# Altium schematic sheet core.SchDoc
size A4; Organization: GPA Robotics; DocumentNumber: 3; Revision: REV 0; SheetNumber: 3; SheetTotal: 4
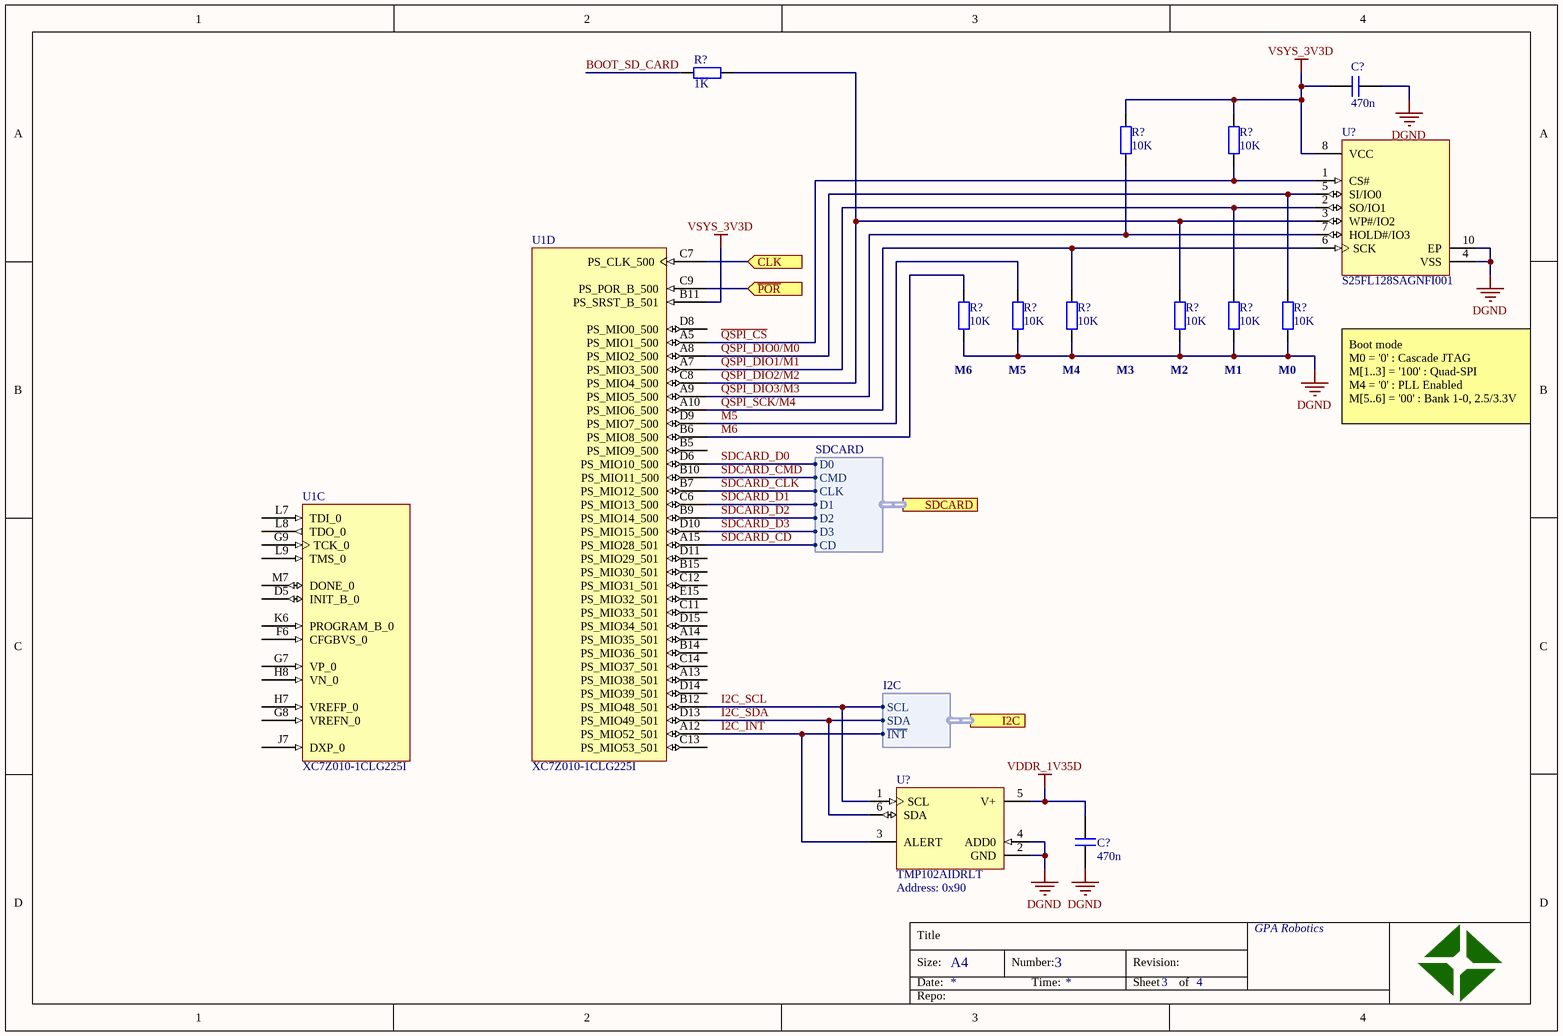
[diagram p0: core.SchDoc]

## Parts
(Parts that share a designator on the sheet are numbered #1, #2 ... from top to bottom, then left to right.)
C?#1  value 470n  [CAPC1608X08N]  (hidden comment: cap)
C?#2  value 470n  [CAPC1608X08N]  (hidden comment: cap)
R?#1  value 1K  [RESC1005X04N]  (hidden comment: res)
R?#2  value 10K  [RESC1005X04N]  (hidden comment: res)
R?#3  value 10K  [RESC1005X04N]  (hidden comment: res)
R?#4  value 10K  [RESC1005X04N]  (hidden comment: res)
R?#5  value 10K  [RESC1005X04N]  (hidden comment: res)
R?#6  value 10K  [RESC1005X04N]  (hidden comment: res)
R?#7  value 10K  [RESC1005X04N]  (hidden comment: res)
R?#8  value 10K  [RESC1005X04N]  (hidden comment: res)
R?#9  value 10K  [RESC1005X04N]  (hidden comment: res)
U1  XC7Z010-1CLG225I  [CLG225]  (parts C,D of 8)
U?#1  S25FL128SAGNFI001  [SPSN-WSON-8_N]
U?#2  TMP102AIDRLT  Address: 0x90  [DRL0006A_L]

## Ports
CLK (in), I2C (harness I2C), SDCARD (harness SDCARD), ~{POR} (in)

## Harnesses
I2C: SDA, SCL, ~{INT}
SDCARD: D0, D1, D2, D3, CMD, CLK, CD

## Nets
DGND: C?#1.1 C?#2.2 R?#4.1 R?#5.1 R?#6.1 R?#7.1 R?#8.1 R?#9.1 U?#1.4(VSS) U?#1.10(EP) U?#2.2(GND) U?#2.4(ADD0)
VDDR_1V35D: C?#2.1 U?#2.5(V+)
VSYS_3V3D: C?#1.2 R?#2.2 R?#3.2 U1.B11(PS_SRST_B_501) U?#1.8(VCC)
~{POR}: U1.C9(PS_POR_B_500) ; port ~{POR}
~{QSPI_CS}: R?#3.1 U1.A5(PS_MIO1_500) U?#1.1(CS#)
BOOT_SD_CARD: R?#1.2
CLK: U1.C7(PS_CLK_500) ; port CLK
I2C_INT: U1.A12(PS_MIO52_501) U?#2.3(ALERT) ; port I2C.~{INT}
I2C_SCL: U1.B12(PS_MIO48_501) U?#2.1(SCL) ; port I2C.SCL
I2C_SDA: U1.D13(PS_MIO49_501) U?#2.6(SDA) ; port I2C.SDA
M5: R?#5.2 U1.D9(PS_MIO7_500)
M6: R?#4.2 U1.B6(PS_MIO8_500)
QSPI_DIO0/M0: R?#9.2 U1.A8(PS_MIO2_500) U?#1.5(SI/IO0)
QSPI_DIO1/M1: R?#8.2 U1.A7(PS_MIO3_500) U?#1.2(SO/IO1)
QSPI_DIO2/M2: R?#1.1 R?#7.2 U1.C8(PS_MIO4_500) U?#1.3(WP#/IO2)
QSPI_DIO3/M3: R?#2.1 U1.A9(PS_MIO5_500) U?#1.7(HOLD#/IO3)
QSPI_SCK/M4: R?#6.2 U1.A10(PS_MIO6_500) U?#1.6(SCK)
SDCARD_CD: U1.A15(PS_MIO28_501) ; port SDCARD.CD
SDCARD_CLK: U1.B7(PS_MIO12_500) ; port SDCARD.CLK
SDCARD_CMD: U1.B10(PS_MIO11_500) ; port SDCARD.CMD
SDCARD_D0: U1.D6(PS_MIO10_500) ; port SDCARD.D0
SDCARD_D1: U1.C6(PS_MIO13_500) ; port SDCARD.D1
SDCARD_D2: U1.B9(PS_MIO14_500) ; port SDCARD.D2
SDCARD_D3: U1.D10(PS_MIO15_500) ; port SDCARD.D3

Not connected (* = marked no-connect by the designer): U1 A13(PS_MIO38_501) A14(PS_MIO35_501) B5(PS_MIO9_500) B14(PS_MIO36_501) B15(PS_MIO30_501) C11(PS_MIO33_501) C12(PS_MIO31_501) C13(PS_MIO53_501) C14(PS_MIO37_501) D5(INIT_B_0) D8(PS_MIO0_500) D11(PS_MIO29_501) D14(PS_MIO39_501) D15(PS_MIO34_501) E15(PS_MIO32_501) F6(CFGBVS_0) G7(VP_0) G8(VREFN_0) G9(TCK_0) H7(VREFP_0) H8(VN_0) J7(DXP_0) K6(PROGRAM_B_0) L7(TDI_0) L8(TDO_0) L9(TMS_0) M7(DONE_0)

## Notes on the sheet
- (near R?#4) M6
- (near R?#5) M5
- (near R?#6) M4
- M3
- (near R?#7) M2
- (near R?#8) M1
- (near R?#9) M0
- Boot mode
  M0 = '0' : Cascade JTAG
  M[1..3] = '100' : Quad-SPI
  M4 = '0' : PLL Enabled
  M[5..6] = '00' : Bank 1-0, 2.5/3.3V
- Title
- Size:
- Date:
- A4
- Number:
- Time:
- Revision:
- Sheet
- of
- Repo:

## Library data of the parts
C?#1 C?#2 = cap: Capacitor; voltage: *; type: *; #digikey: *; #mouser: *
R?#1-R?#9 = res: Resistor; power: *; voltage: *; #digikey: *; #mouser: *
U1 = CMP-0382-00001-1: 667 MHz Zynq™-7000 AP SoC, 88 PS I/O, 54 FPGA I/O, 225-Ball BGA, Speed Grade 1, Industrial Grade, Pb-Free; LUTs: 17600; Extensible Block RAM (# 36Kb Blocks): 240 KB (60); Speed Grade: -1; Flip Flops: 35200; DatasheetVersion: v1.2; ComponentLink4Description: Package File; ComponentLink1URL: http://www.xilinx.com/support/documentation/data_sheets/ds190-Zynq-7000-Overview.pdf; ComponentLink5URL: http://www.xilinx.com/support/documentation/user_guides/ug865-Zynq-7000-Pkg-Pinout.pdf; ComponentLink5Description: Packaging and Pinout; PartNumber: XC7Z010-1CLG225I; PackageVersion: Rev 1.2, 02/2013; ComponentLink3Description: DC and AC Switching Characteristics; ComponentLink2URL: http://www.xilinx.com/support/documentation/user_guides/ug865-Zynq-7000-Pkg-Pinout.pdf; ComponentLink3URL: http://www.xilinx.com/support/documentation/data_sheets/ds187-XC7Z010-XC7Z020-Data-Sheet.pdf; ComponentLink6URL: http://www.xilinx.com/support/documentation/user_guides/ug483_7Series_PCB.pdf; ComponentLink2Description: Package Specification; PackageReference: CLG225; ComponentLink1Description: Datasheet; ComponentLink4URL: http://www.xilinx.com/support/packagefiles/z7packages/xc7z010clg225pkg.txt; Generic Part Number: XC7Z010; ComponentLink6Description: PCB and Layout Guide; Mounting Technology: Surface Mount; PackageDescription: Wire-Bond Chip-Scale BGA, Body 13 x 13 mm, 0.8 mm Pitch; Code_JEDEC: MO-275-HHAC-1; RoHS: Pb-Free
U?#1 = CMP-1329-00028-1: MirrorBit Flash Non-Volatile Memory CMOS 3.0 Volt Core with Versatile I/O, Serial Peripheral Interface with Multi-I/O, 128 Mbit, 133 MHz, -40 to 85 degC, 8-Pin WSON (WNG008), RoHS, Tube; Manufacturer: Spansion; OTP: 1024 B; Speed: 133 MHz; VCC: 2.7 to 3.6 V; ComponentLink3Description: Package Specification; ComponentLink2URL: http://www.spansion.com/Support/Datasheets/S25FL128S_256S_00.pdf; Packing: Tube; PartNumber: S25FL128SAGNFI001; PackageDescription: 8-Pin Plastic Small Outline, Body 6 x 8 mm, Pitch 1.27 mm; DatasheetVersion: Rev. 08; Temperature Range: -40 to 85 degC; ComponentLink3URL: http://www.spansion.com/Support/Datasheets/S25FL128S_256S_00.pdf; RoHS: TRUE; ComponentLink2Description: Datasheet; Density: 128 Mbit; ComponentLink1Description: Manufacturer URL; ComponentLink1URL: http://www.spansion.com/Pages/Default.aspx; Mounting Technology: Surface Mount
U?#2 = CMP-1685-00013-1: Low Power Digital Temperature Sensor with SMBus and Two-Wire Serial Interface, 1.4 to 3.6 V, -40 to 125 degC, 6-Pin SOT (DRL), Green (RoHS & no Sb/Br), Tape and Reel; ComponentLink3URL: http://www.ti.com/lit/ml/mpds159c/mpds159c.pdf; PackageVersion: 4205622-3/D, 08/2207; ComponentLink2Description: Datasheet; PackageReference: DRL0006A; ComponentLink2URL: http://www.ti.com/lit/ds/symlink/tmp102.pdf; ComponentLink3Description: Package Specification; ComponentLink1Description: Manufacturer URL; DatasheetVersion: SBOS397F, 12/2015; PackageDescription: 6-Pin Plastic Small Outline, Body 1.6 x 1.2 mm, Pitch 0.5 mm; ComponentLink1URL: http://www.ti.com/